# Altium schematic sheet IziDAP-MainSheet.SchDoc
size A; SheetNumber: 1; SheetTotal: 1
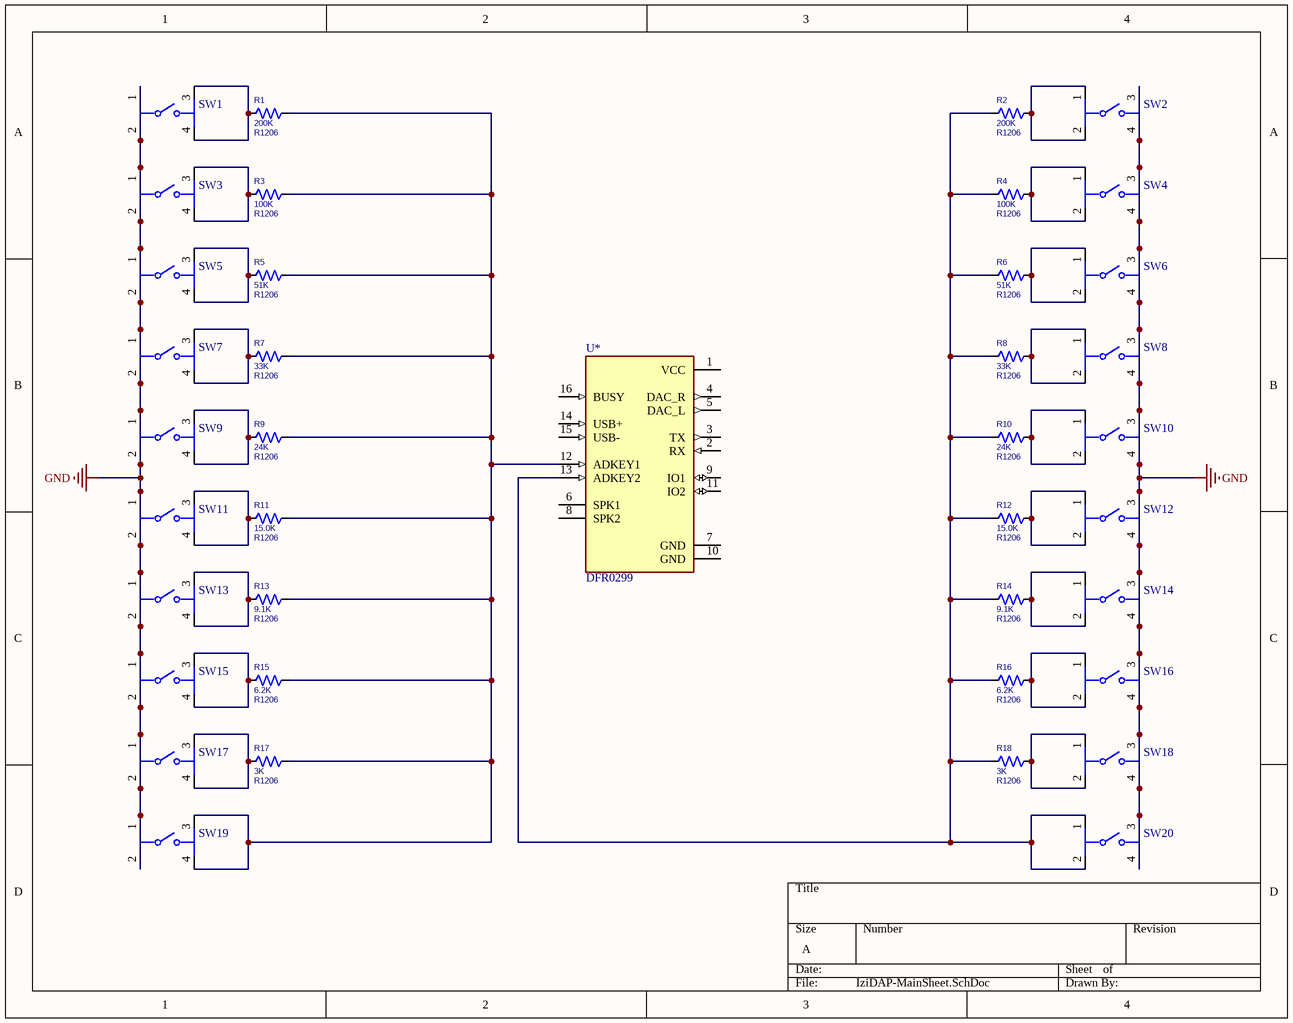
[diagram p0: IziDAP-MainSheet.SchDoc]

## Parts
R1  value 200K  Package: R1206  [RESC3216X84N]  (hidden comment: 070-00092-025)
R2  value 200K  Package: R1206  [RESC3216X84N]  (hidden comment: 070-00092-025)
R3  value 100K  Package: R1206  [RESC3216X84N]  (hidden comment: 070-00478-005)
R4  value 100K  Package: R1206  [RESC3216X84N]  (hidden comment: 070-00478-005)
R5  value 51K  Package: R1206  [RESC3216X84N]  (hidden comment: 070-00582-016)
R6  value 51K  Package: R1206  [RESC3216X84N]  (hidden comment: 070-00582-016)
R7  value 33K  Package: R1206  [RESC3216X84N]
R8  value 33K  Package: R1206  [RESC3216X84N]
R9  value 24K  Package: R1206  [RESC3216X84N]
R10  value 24K  Package: R1206  [RESC3216X84N]
R11  value 15.0K  Package: R1206  [RESC3216X84N]  (hidden comment: 070-00417-000)
R12  value 15.0K  Package: R1206  [RESC3216X84N]  (hidden comment: 070-00417-000)
R13  value 9.1K  Package: R1206  [RESC3216X84N]  (hidden comment: 070-00417-000)
R14  value 9.1K  Package: R1206  [RESC3216X84N]  (hidden comment: 070-00417-000)
R15  value 6.2K  Package: R1206  [RESC3216X84N]  (hidden comment: 070-00417-000)
R16  value 6.2K  Package: R1206  [RESC3216X84N]  (hidden comment: 070-00417-000)
R17  value 3K  Package: R1206  [RESC3216X84N]  (hidden comment: 070-00417-000)
R18  value 3K  Package: R1206  [RESC3216X84N]  (hidden comment: 070-00417-000)
SW1  2-1825910-6  [FP-2-1825910-6-MFG]  (value not drawn)
SW2  2-1825910-6  [FP-2-1825910-6-MFG]  (value not drawn)
SW3  2-1825910-6  [FP-2-1825910-6-MFG]  (value not drawn)
SW4  2-1825910-6  [FP-2-1825910-6-MFG]  (value not drawn)
SW5  2-1825910-6  [FP-2-1825910-6-MFG]  (value not drawn)
SW6  2-1825910-6  [FP-2-1825910-6-MFG]  (value not drawn)
SW7  2-1825910-6  [FP-2-1825910-6-MFG]  (value not drawn)
SW8  2-1825910-6  [FP-2-1825910-6-MFG]  (value not drawn)
SW9  2-1825910-6  [FP-2-1825910-6-MFG]  (value not drawn)
SW10  2-1825910-6  [FP-2-1825910-6-MFG]  (value not drawn)
SW11  2-1825910-6  [FP-2-1825910-6-MFG]  (value not drawn)
SW12  2-1825910-6  [FP-2-1825910-6-MFG]  (value not drawn)
SW13  2-1825910-6  [FP-2-1825910-6-MFG]  (value not drawn)
SW14  2-1825910-6  [FP-2-1825910-6-MFG]  (value not drawn)
SW15  2-1825910-6  [FP-2-1825910-6-MFG]  (value not drawn)
SW16  2-1825910-6  [FP-2-1825910-6-MFG]  (value not drawn)
SW17  2-1825910-6  [FP-2-1825910-6-MFG]  (value not drawn)
SW18  2-1825910-6  [FP-2-1825910-6-MFG]  (value not drawn)
SW19  2-1825910-6  [FP-2-1825910-6-MFG]  (value not drawn)
SW20  2-1825910-6  [FP-2-1825910-6-MFG]  (value not drawn)
U*  DFR0299  [DFR0299]

## Nets
GND: SW1.1 SW1.2 SW2.3 SW2.4 SW3.1 SW3.2 SW4.3 SW4.4 SW5.1 SW5.2 SW6.3 SW6.4 SW7.1 SW7.2 SW8.3 SW8.4 SW9.1 SW9.2 SW10.3 SW10.4 SW11.1 SW11.2 SW12.3 SW12.4 SW13.1 SW13.2 SW14.3 SW14.4 SW15.1 SW15.2 SW16.3 SW16.4 SW17.1 SW17.2 SW18.3 SW18.4 SW19.1 SW19.2 SW20.3 SW20.4
NetR1_1: R1.1 SW1.3 SW1.4
NetR1_2: R1.2 R3.2 R5.2 R7.2 R9.2 R11.2 R13.2 R15.2 R17.2 SW19.3 SW19.4 U*.12(ADKEY1)
NetR2_1: R2.1 R4.1 R6.1 R8.1 R10.1 R12.1 R14.1 R16.1 R18.1 SW20.1 SW20.2 U*.13(ADKEY2)
NetR2_2: R2.2 SW2.1 SW2.2
NetR3_1: R3.1 SW3.3 SW3.4
NetR4_2: R4.2 SW4.1 SW4.2
NetR5_1: R5.1 SW5.3 SW5.4
NetR6_2: R6.2 SW6.1 SW6.2
NetR7_1: R7.1 SW7.3 SW7.4
NetR8_2: R8.2 SW8.1 SW8.2
NetR9_1: R9.1 SW9.3 SW9.4
NetR10_2: R10.2 SW10.1 SW10.2
NetR11_1: R11.1 SW11.3 SW11.4
NetR12_2: R12.2 SW12.1 SW12.2
NetR13_1: R13.1 SW13.3 SW13.4
NetR14_2: R14.2 SW14.1 SW14.2
NetR15_1: R15.1 SW15.3 SW15.4
NetR16_2: R16.2 SW16.1 SW16.2
NetR17_1: R17.1 SW17.3 SW17.4
NetR18_2: R18.2 SW18.1 SW18.2

Not connected (* = marked no-connect by the designer): U* 1(VCC) 2(RX) 3(TX) 4(DAC_R) 5(DAC_L) 6(SPK1) 7(GND) 8(SPK2) 9(IO1) 10(GND) 11(IO2) 14(USB+) 15(USB-) 16(BUSY)

## Library data of the parts
R1 R2 = CMP-055-000093-5: RES, THICK FILM, SMT, 1/4W, 1%, RES1206, 200K; Manufacturer P/N: RK73H2BLTD2003F; Manufacturer: KOA-Speer Electronics, Inc.; Tolerance: 1%; Avidyne P/N: 070-00092-025; Wattage: 1/4W; Source: Resistors.SCHLIB; Design Item ID: 070-00092-025
R3 R4 = CMP-055-000723-5: RES, THICK FILM CHIP, SMT, 1/8W, 1%, RES1206, 100K OHM; Manufacturer P/N: ERJ-8ENF1003V; Manufacturer: Panasonic Electronic Devices, Corp.; Tolerance: 1%; Wattage: 1/8W; Avidyne P/N: 070-00478-005; Design Item ID: 070-00478-005; Source: Resistors.SCHLIB
R5 R6 = CMP-055-001077-5: RES, THICK FILM, SMT, 1/8W, 5%, 1206, 51K OHM; Manufacturer P/N: CRCW1206513JRT1; Manufacturer: Vishay-Dale Intertechnology, Inc; Tolerance: 5%; Cost: 0.0027; Wattage: 1/8W; Design Item ID: 070-00582-016; Avidyne P/N: 070-00582-016; Source: Resistors.SCHLIB
R7 R8 = Resistor: RES, 1/8W, 1%, 1206, 33K OHM; Manufacturer P/N: ERJ-8ENF1502V; Manufacturer: Panasonic Electronic Devices, Corp.; Avidyne P/N: 070-00417-000; Tolerance: 1%; Wattage: 1/8W; Source: Resistors.SCHLIB; Cost: 0.0031; Design Item ID: 070-00417-000
R9 R10 = Resistor: RES, 1/8W, 1%, 1206, 24K OHM; Manufacturer P/N: ERJ-8ENF1502V; Manufacturer: Panasonic Electronic Devices, Corp.; Avidyne P/N: 070-00417-000; Tolerance: 1%; Wattage: 1/8W; Source: Resistors.SCHLIB; Cost: 0.0031; Design Item ID: 070-00417-000
R11 R12 = CMP-055-000375-5: RES, 1/8W, 1%, 1206, 15.0K OHM; Manufacturer P/N: ERJ-8ENF1502V; Manufacturer: Panasonic Electronic Devices, Corp.; Tolerance: 1%; Wattage: 1/8W; Source: Resistors.SCHLIB; Cost: 0.0031; Design Item ID: 070-00417-000; Avidyne P/N: 070-00417-000
R13 R14 = Resistor: RES, 1/8W, 1%, 1206, 9.1K OHM; Manufacturer P/N: ERJ-8ENF1502V; Manufacturer: Panasonic Electronic Devices, Corp.; Tolerance: 1%; Wattage: 1/8W; Source: Resistors.SCHLIB; Cost: 0.0031; Design Item ID: 070-00417-000; Avidyne P/N: 070-00417-000
R15 R16 = Resistor: RES, 1/8W, 1%, 1206, 6.2K OHM; Manufacturer P/N: ERJ-8ENF1502V; Manufacturer: Panasonic Electronic Devices, Corp.; Tolerance: 1%; Wattage: 1/8W; Source: Resistors.SCHLIB; Cost: 0.0031; Design Item ID: 070-00417-000; Avidyne P/N: 070-00417-000
R17 R18 = Resistor: RES, 1/8W, 1%, 1206, 3K OHM; Manufacturer P/N: ERJ-8ENF1502V; Manufacturer: Panasonic Electronic Devices, Corp.; Tolerance: 1%; Wattage: 1/8W; Source: Resistors.SCHLIB; Cost: 0.0031; Design Item ID: 070-00417-000; Avidyne P/N: 070-00417-000
SW1-SW20 = CMP-03407-000025-1: SWITCH TACTILE SPST-NO 0.05A 24V; Max Current Rating: 50mA; Actuator Type: Standard; Illumination Type: Non-Illuminated; Actuator Material: Nylon; Throw Configuration: SPST; Actuator Length: 0.37inch; Operating Force: 100gf; Switch Function: Off-Mom; Mechanical Life: 100000Cycles; Actuator Color: Brown; Switch Travel: 0.25mm; Packaging: Loose Piece; Series: FSMJ; RoHS Compliant: Yes; Mount: Through Hole; Lead Free: Lead Free; Length: 5.99mm; Voltage Rating (DC): 24V; Type: Switch; Contact Current Rating: 50mA; Contact Material: Copper Alloy; Max Operating Temperature: 85°C; Min Operating Temperature: -35°C; Termination: PC Pin; ELV: Compliant; Orientation: Straight; Contact Plating: Silver
U* = DFR0299: DFRobot DFR0299 DFPlayer - A Mini MP3 Player For Arduino; Supplier: DigiKey; Supplier Part Number: 1738-1041-ND; Manufacturer: DFRobot; Manufacturer Part Number: DFR0299; Category: Uncategorized; Stock: 972; Pricing: 1=5.9 (USD); RoHS: Non-Compliant; Schedule B: 8542900000, 8542900000|8542900000|8542900000|8542900000|8542900000; Supplier 1: DigiKey; Supplier Part Number 1: 1738-1041-ND